# EAGLE design raspi-rnc (EAGLE 6.6.0)
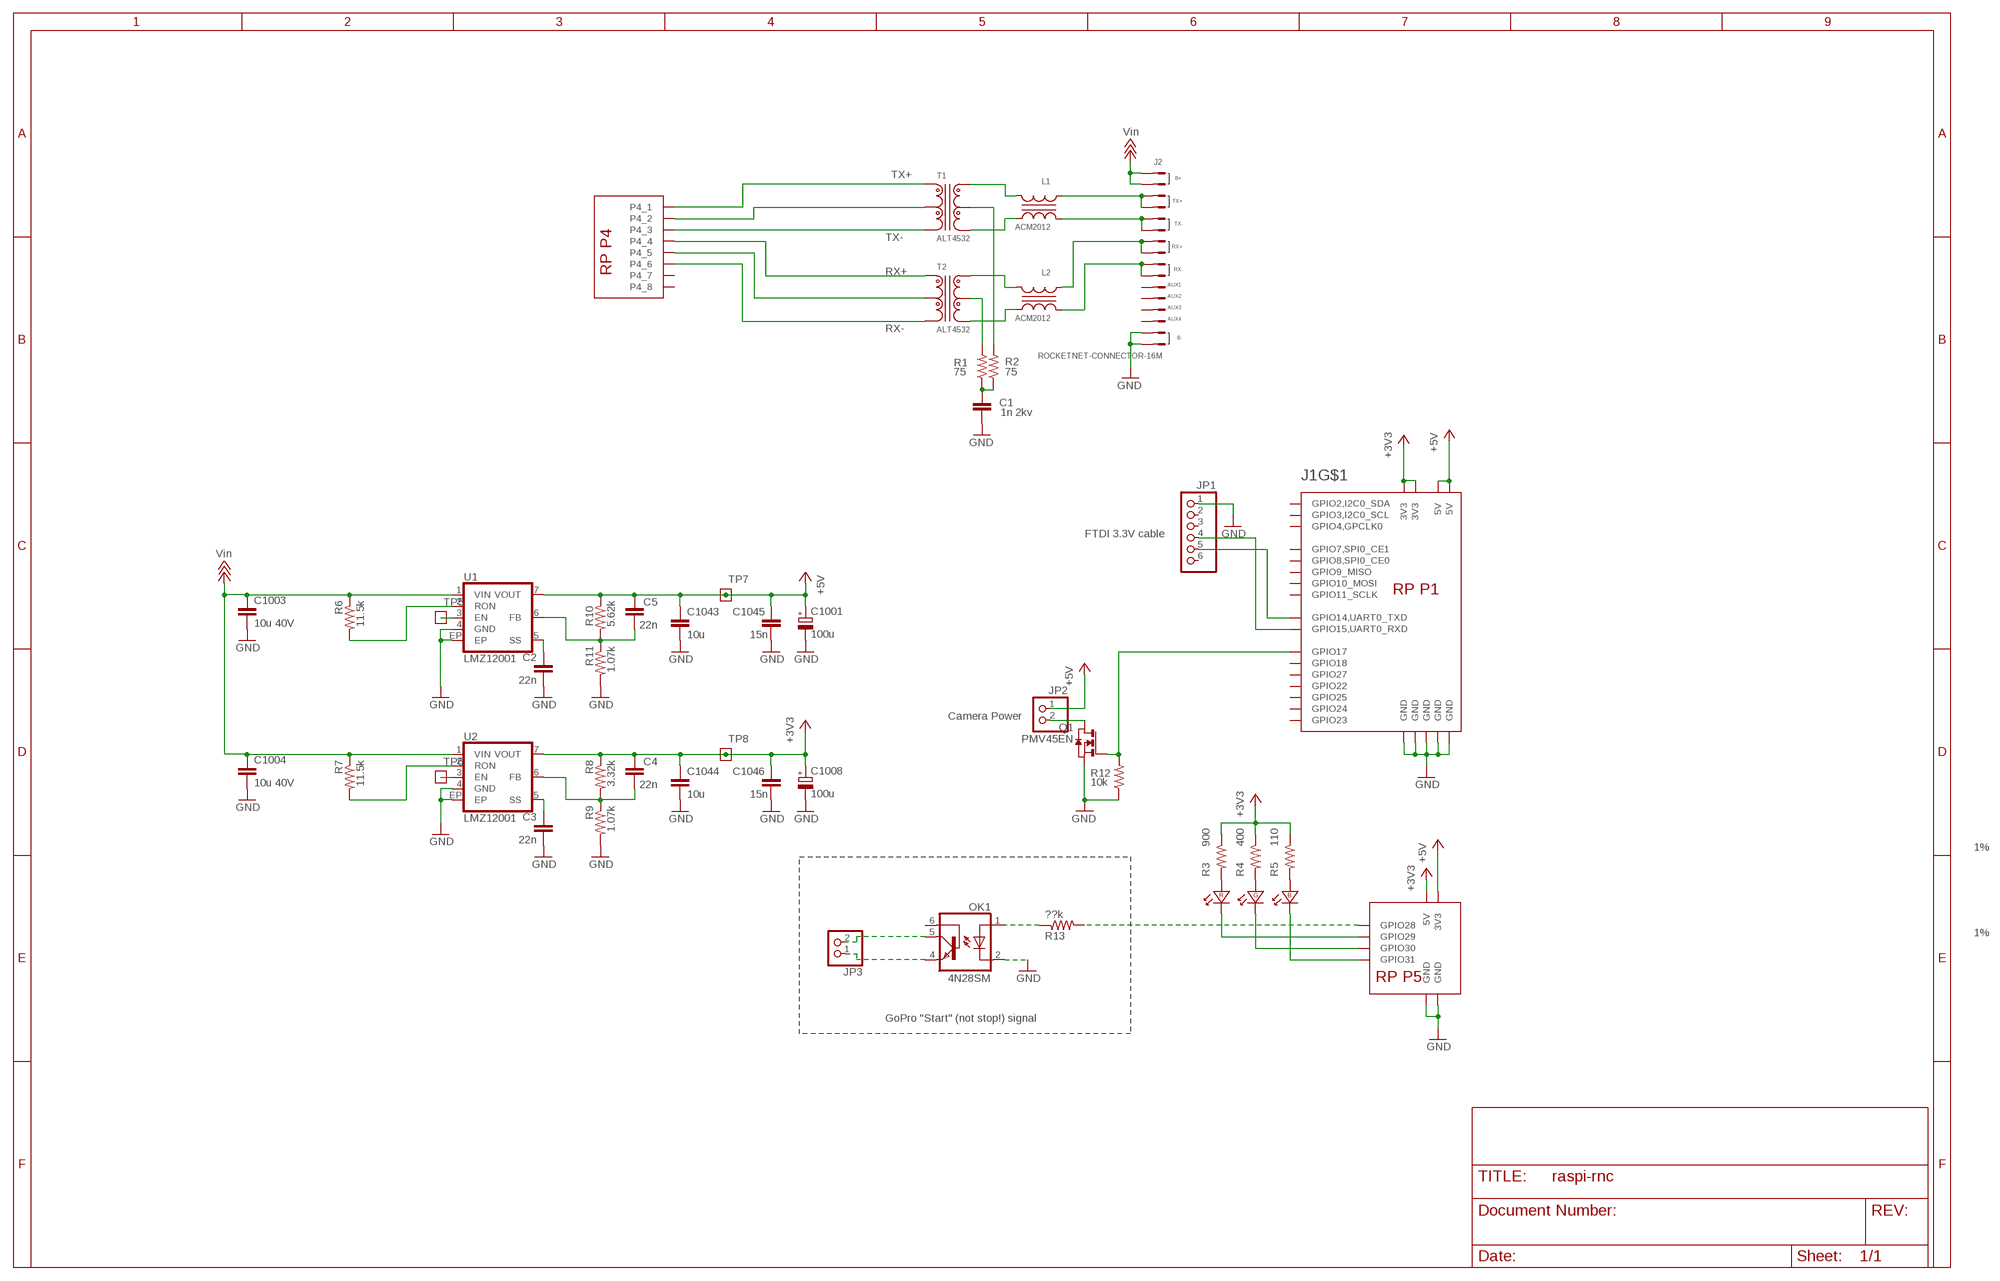
[diagram p0: schematic, sheet 1]

## Parts
C1  1n 2kv  C-EU0603-B-NOSILK  [0603-B-NOSILK]
C2  22n  C-EU0603-B-NOSILK  [0603-B-NOSILK]
C3  22n  C-EU0603-B-NOSILK  [0603-B-NOSILK]
C4  22n  C-EU0603-B-NOSILK  [0603-B-NOSILK]
C5  22n  C-EU0603-B-NOSILK  [0603-B-NOSILK]
C1001  100u  CPOL-EUD/7343-31R  [D/7343-31R]
C1003  10u 40V  C-EU0805-B-NOSILK  [0805-B-NOSILK]
C1004  10u 40V  C-EU0805-B-NOSILK  [0805-B-NOSILK]
C1008  100u  CPOL-EUD/7343-31R  [D/7343-31R]
C1043  10u  C-EU0805-B-NOSILK  [0805-B-NOSILK]
C1044  10u  C-EU0805-B-NOSILK  [0805-B-NOSILK]
C1045  15n  C-EU0603-B-NOSILK  [0603-B-NOSILK]
C1046  15n  C-EU0603-B-NOSILK  [0603-B-NOSILK]
J1  RP-REV2-MOAR  [RP_REV2_MOAR]
J2  ROCKETNET-CONNECTOR-16M  [ROCKETNET-M-16]
JP1  PINHD-1X6  [1X06]
JP2  PINHD-1X2  [1X02]
JP3  PINHD-1X2  [1X02]
L1  ACM2012  [TDK-ACM2012]
L2  ACM2012  [TDK-ACM2012]
LED3  LED_RGB_PLCC-6  [PLCC-6]
OK1  4N28SM  [DIL6-SMD]
Q1  PMV45EN  [SOT23]
R1  75  R-US_0603-B-NOSILK  [0603-B-NOSILK]
R2  75  R-US_0603-B-NOSILK  [0603-B-NOSILK]
R3  900  R-US_0603-B-NOSILK  [0603-B-NOSILK]
R4  400  R-US_0603-B-NOSILK  [0603-B-NOSILK]
R5  110  R-US_0603-B-NOSILK  [0603-B-NOSILK]
R6  11.5k  R-US_0603-B-NOSILK  [0603-B-NOSILK]
R7  11.5k  R-US_0603-B-NOSILK  [0603-B-NOSILK]
R8  3.32k  R-US_0603-B-NOSILK  [0603-B-NOSILK]
R9  1.07k  R-US_0603-B-NOSILK  [0603-B-NOSILK]
R10  5.62k  R-US_0603-B-NOSILK  [0603-B-NOSILK]
R11  1.07k  R-US_0603-B-NOSILK  [0603-B-NOSILK]
R12  10k  R-US_0603-B-NOSILK  [0603-B-NOSILK]
R13  ??k  R-US_0603-B-NOSILK  [0603-B-NOSILK]
T1  ALT4532  [TDK-ALT4532]
T2  ALT4532  [TDK-ALT4532]
TP5  TEST-POINT  [2MM-TEST-POINT]
TP6  TEST-POINT  [2MM-TEST-POINT]
TP7  TEST-POINT  [2MM-TEST-POINT]
TP8  TEST-POINT  [2MM-TEST-POINT]
U1  LMZ12001  LMZ14203  [TO-PMOD-7]
U2  LMZ12001  LMZ14203  [TO-PMOD-7]

## Nets
+3V3: C4.1 C1008.+ C1044.1 C1046.1 J1.P1_1(3V3) J1.P1_17(3V3) J1.P5_1(5V) R3.1 R4.1 R5.1 R8.1 TP8.1 U2.7(VOUT)
+5V: C5.1 C1001.+ C1043.1 C1045.1 J1.P1_2(5V) J1.P1_4(5V) J1.P5_2(3V3) JP2.1 R10.1 TP7.1 U1.7(VOUT)
GND: C1.2 C2.2 C3.2 C1001.- C1003.2 C1004.2 C1008.- C1043.2 C1044.2 C1045.2 C1046.2 J1.P1_6(GND) J1.P1_9(GND) J1.P1_14(GND) J1.P1_20(GND) J1.P1_25(GND) J1.P5_7(GND) J1.P5_8(GND) J2.B-@1(B-) J2.B-@2(B-) JP1.1 OK1.2(C) Q1.2(S) R9.2 R11.2 R12.1 U1.4(GND) U1.EP U2.4(GND) U2.EP
N$1: J1.P4_2 T1.6
N$2: J1.P5_4(GPIO29) LED3.6(R:K)
N$3: L1.4 T1.5
N$4: J1.P5_5(GPIO30) LED3.2(G:K)
N$5: L1.3 T1.4
N$6: L2.4 T2.5
N$7: L2.3 T2.4
N$8: J2.T+@13(TX+) J2.T+@14(TX+) L1.1
N$9: J2.T-@9(TX-) J2.T-@11(TX-) L1.2
N$10: J2.R+@5(RX+) J2.R+@7(RX+) L2.1
N$11: J1.P4_1 T1.1
N$12: J1.P4_3 T1.2
N$13: J1.P4_4 T2.1
N$14: J1.P4_6 T2.2
N$15: J1.P5_6(GPIO31) LED3.5(B:K)
N$16: J1.P4_5 T2.6
N$17: C3.1 U2.5(SS)
N$18: C2.1 U1.5(SS)
N$19: J2.R-@3(RX-) J2.R-@4(RX-) L2.2
N$20: J1.P5_3(GPIO28) R13.2
N$21: OK1.1(A) R13.1
N$23: JP3.2 OK1.5(COL)
N$24: R6.2 U1.2(RON)
N$25: C1.1 R1.1 R2.1
N$26: R1.2 T2.3
N$27: R2.2 T1.3
N$28: LED3.1(R:A) R3.2
N$29: LED3.3(G:A) R4.2
N$30: LED3.4(B:A) R5.2
N$31: R7.2 U2.2(RON)
N$32: TP5.1 U1.3(EN)
N$33: TP6.1 U2.3(EN)
N$34: C4.2 R8.2 R9.1 U2.6(FB)
N$35: C5.2 R10.2 R11.1 U1.6(FB)
N$36: J1.P1_10(GPIO15,UART0_RXD) JP1.4
N$37: J1.P1_8(GPIO14,UART0_TXD) JP1.5
N$38: J1.P1_26(GPIO17) Q1.1(G) R12.2
N$39: JP3.1 OK1.4(EMI)
N$40: JP2.2 Q1.3(D)
TRIPLE_UP_ARROW: C1003.1 C1004.1 J2.B+@15(B+) J2.B+@16(B+) R6.1 R7.1 U1.1(VIN) U2.1(VIN) ; supply symbol labelled Vin
Unconnected: J1.P1_3(GPIO2,I2C0_SDA) J1.P1_5(GPIO3,I2C0_SCL) J1.P1_7(GPIO4,GPCLK0) J1.P1_11(GPIO7,SPI0_CE1) J1.P1_12(GPIO8,SPI0_CE0) J1.P1_13(GPIO27) J1.P1_15(GPIO22) J1.P1_16(GPIO23) J1.P1_18(GPIO24) J1.P1_19(GPIO10_MOSI) J1.P1_21(GPIO9_MISO) J1.P1_22(GPIO25) J1.P1_23(GPIO11_SCLK) J1.P1_24(GPIO18) J1.P4_7 J1.P4_8 J2.A1(AUX1) J2.A2(AUX2) J2.A3(AUX3) J2.A4(AUX4) JP1.2 JP1.3 JP1.6 OK1.6(BAS)

## Notes on the sheet
- TX+
- TX-
- RX+
- RX-
- FTDI 3.3V cable
- Camera Power
- 1%
- 1%
- GoPro "Start" (not stop!) signal

## Library data of the parts
C1-C5 C1003 C1004 C1043-C1046 = rcl_custom:C-EU: CAPACITOR, European symbol
C1001 C1008 = rcl:CPOL-EU: POLARIZED CAPACITOR, European symbol
J1 = RaspberryPi:RP-REV2-MOAR
J2 = rocketnet-connector:ROCKETNET-CONNECTOR-16
JP1 = pinhead:PINHD-1X6: PIN HEADER
JP2 JP3 = pinhead:PINHD-1X2: PIN HEADER
L1 L2 = magnetics:ACM2012
LED3 = Tova:LED_RGB_*: RGB LED with separate contacts for all 3 chips
OK1 = optocoupler:4N*?M: General Purpose 6-Pin Phototransistor Optocouplers Source: http://www.fairchildsemi.com/ds/4N/4N35-M.pdf; MF: FAIRCHILD SEMICONDUCTOR; MPN: 4N28S-M; OC_FARNELL: unknown; OC_NEWARK: 05C3314
Q1 = Tova:PMV45EN
R1-R13 = rcl_custom:R-US_: RESISTOR, American symbol
T1 T2 = magnetics:ALT4532
TP5-TP8 = apdm:TEST-POINT
U1 U2 = SparkFun-PowerIC:LMZ14203: 3A, Simple Switcher Power Module with 42V Maximum Input

## Board
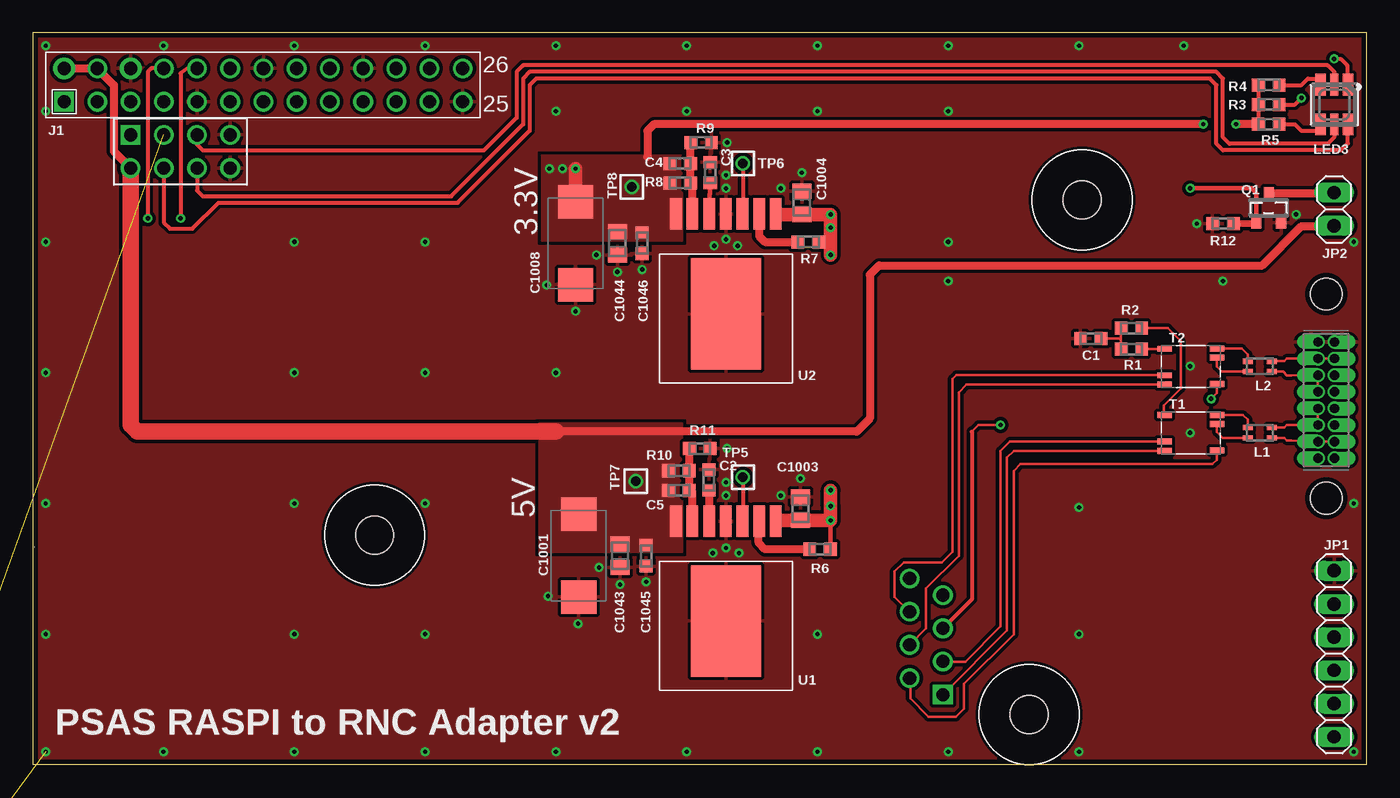
[diagram p1: board, top side]
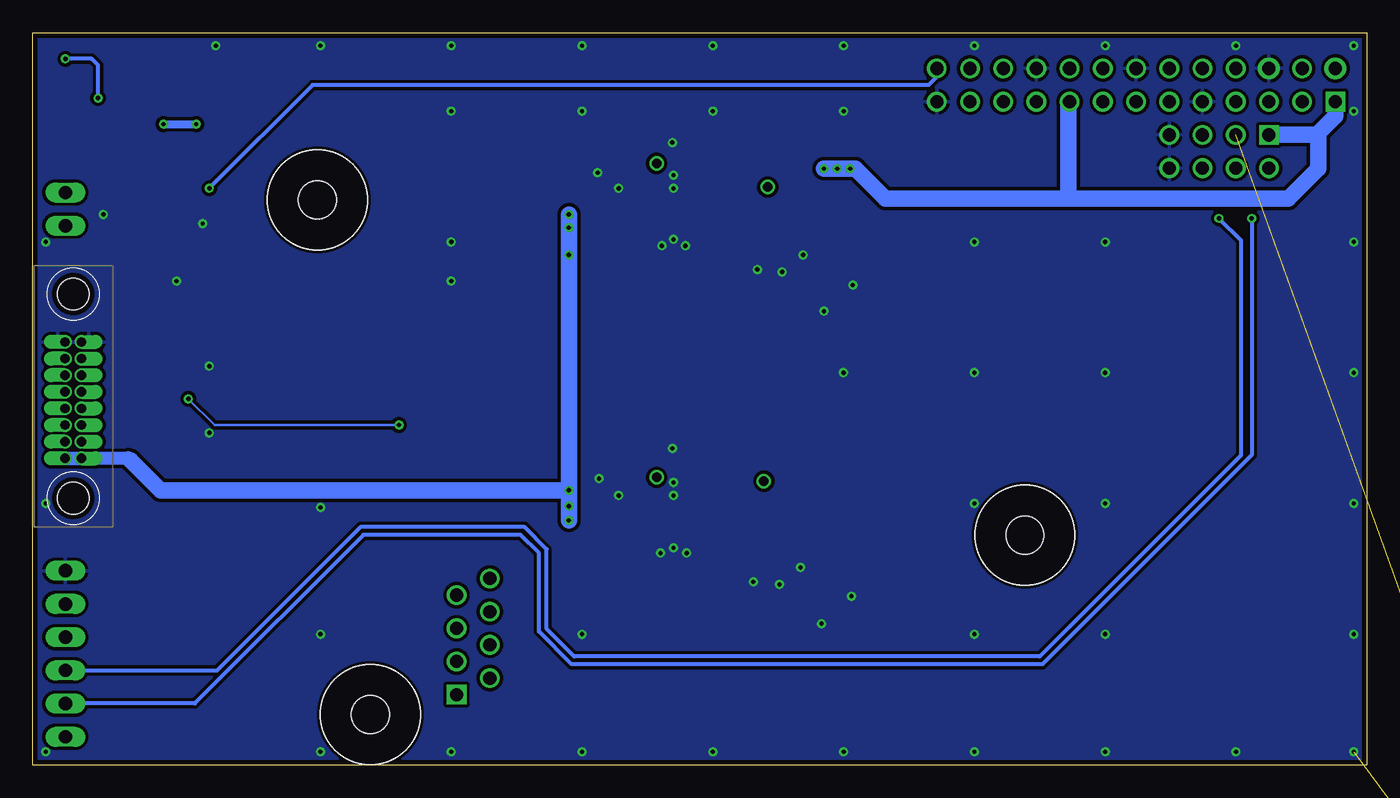
[diagram p2: board, bottom side, seen from below]

Size 102 x 56 mm. Coordinates in mm from the lower left corner, seen from the top.
Outline: 102,0 102,56 0,56 0,0 102,0
Copper layers (1*16): Top 0.0356mm / dielectric 1.5011mm / Bottom 0.0356mm
Design rules "osh-park-2layer *": minimum track width 6mil, minimum drill 13mil, track to track 6mil, track to pad 6mil, pad to pad 6mil, via to via 6mil, smd to smd 6mil, copper to edge 15mil, drill to drill 6mil, minimum pad ring 7mil, minimum via ring 7mil, stop-mask expansion 3mil, vias tented up to drill 20mil, thermal gap 10mil

### Footprints (pad centres in the part's own frame; a part is rotated, then mirrored left to right if it is on the bottom)
0603-B-NOSILK = smd 0.95 x 1: 1 -0.8,0; 2 0.8,0
D/7343-31R = smd 2.55 x 2.7: + 3.175,0; - -3.175,0
0805-B-NOSILK = smd 1.15 x 1.45: 1 -0.9,0; 2 0.9,0
RP_REV2_MOAR = drill 1 square: P1_1 2.4,50.725; P4_1 69.59,5.37; P5_1 7.48,48.185 | drill 1 pad 1.676: P1_2 2.4,53.265; P1_6 7.48,53.265 | drill 1: P1_3 4.94,50.725; P1_4 4.94,53.265; P1_5 7.48,50.725; P1_7 10.02,50.725; P1_8 10.02,53.265; P1_9 12.56,50.725; P1_10 12.56,53.265; P1_11 15.1,50.725; P1_12 15.1,53.265; P1_13 17.64,50.725; P1_14 17.64,53.265; P1_15 20.18,50.725; P1_16 20.18,53.265; P1_17 22.72,50.725; P1_18 22.72,53.265; P1_19 25.26,50.725; P1_20 25.26,53.265; P1_21 27.8,50.725; P1_22 27.8,53.265; P1_23 30.34,50.725; P1_24 30.34,53.265; P1_25 32.88,50.725; P1_26 32.88,53.265; P4_2 67.05,6.64; P4_3 69.59,7.91; P4_4 67.05,9.18; P4_5 69.59,10.45; P4_6 67.05,11.72; P4_7 69.59,12.99; P4_8 67.05,14.26; P5_2 7.48,45.645; P5_3 10.02,48.185; P5_4 10.02,45.645; P5_5 12.56,48.185; P5_6 12.56,45.645; P5_7 15.1,48.185; P5_8 15.1,45.645 | hole 2.9: 80.23,43.215; 26.14,17.565; 76.18,3.845
ROCKETNET-M-16 = drill 0.71 pad 0.95 offset: A1 -1.905,0.635; A2 -0.635,0.635; A3 0.635,0.635; A4 1.905,0.635; B+@15 4.445,-0.635; B+@16 4.445,0.635; B-@1 -4.445,-0.635; B-@2 -4.445,0.635; R+@5 -1.905,-0.635; R+@7 -0.635,-0.635; R-@3 -3.175,-0.635; R-@4 -3.175,0.635; T+@13 3.175,-0.635; T+@14 3.175,0.635; T-@9 0.635,-0.635; T-@11 1.905,-0.635 | hole 2.438: 7.5,0; -8.1,0
1X06 = drill 1.016 long: 1 -6.35,0; 2 -3.81,0; 3 -1.27,0; 4 1.27,0; 5 3.81,0; 6 6.35,0
1X02 = drill 1.016 long: 1 -1.27,0; 2 1.27,0
TDK-ACM2012 = smd 0.75 x 0.4: 1 -0.925,0.4; 2 -0.925,-0.4; 3 0.925,-0.4; 4 0.925,0.4
PLCC-6 = smd 1.65 x 0.8: 1 -1.525,1.05; 3 -1.525,-1.05; 4 1.525,-1.05; 6 1.525,1.05 | smd 1.65 x 0.6: 2 -1.525,0; 5 1.525,0
DIL6-SMD = smd 1.78 x 1.52: 1 -2.54,-4.645; 2 0,-4.645; 3 2.54,-4.645; 4 2.54,4.645; 5 0,4.645; 6 -2.54,4.645
SOT23 = smd 0.787 x 0.889: 1 -0.953,-1.143; 2 0.953,-1.143; 3 0,1.143
TDK-ALT4532 = smd 1.1 x 0.45: 1 -2,-1.375; 2 -2,-0.675; 3 -2,1.35; 4 2,1.375; 5 2,0.675; 6 2,-1.35
2MM-TEST-POINT = drill 0.737: 1 0,0
TO-PMOD-7 = smd 0.89 x 2.41: 1 -3.81,-7.63; 2 -2.54,-7.63; 3 -1.27,-7.63; 4 0,-7.63; 5 1.27,-7.63; 6 2.57,-7.63; 7 3.81,-7.63 | smd 5.35 x 8.54: EP 0,0

### Placement (x,y rotation side)
C1  80.9,32.6 180 top
C2  51.7,21.8 90 top
C3  51.8,45.3 90 top
C4  49.5,46 0 top
C5  49.4,21 0 top
C1001  41.74,16.01 90 top
C1003  58.7,19.6 90 top
C1004  58.8,43 90 top
C1008  41.5,39.9 90 top
C1043  44.9,16 270 top
C1044  44.7,39.9 270 top
C1045  46.9,16 270 top
C1046  46.6,39.9 270 top
J1  0,0 0 top
J2  98.9,27.9 270 top
JP1  99.5,8.5 270 top
JP2  99.5,42.5 90 top
JP3  -11.9,-20.8 0 top  (outside the outline)
L1  93.82,25.4 180 top
L2  93.82,30.48 180 top
LED3  99.5,50.5 270 top
OK1  -8.2,-6.8 0 top  (outside the outline)
Q1  94.5,42.6 0 top
R1  84,31.8 0 top
R2  84,33.4 0 top
R3  94.5,50.5 0 top
R4  94.5,52 0 top
R5  94.5,49 0 top
R6  60.2,16.5 180 top
R7  59.3,40 180 top
R8  49.5,44.5 0 top
R9  51.1,47.6 0 top
R10  49.4,22.5 0 top
R11  51,24.2 0 top
R12  91,41.4 0 top
R13  -13.4,-14.7 0 top  (outside the outline)
T1  88.54,25.4 0 top
T2  88.54,30.48 0 top
TP5  54.3,22 0 top
TP6  54.3,46 0 top
TP7  46.1,21.7 0 top
TP8  45.8,44.2 0 top
U1  53,11 180 top
U2  53,34.5 180 top

### Tracks (layer width: path | path; a pad name or v marks a point on that pad's centre or on a via)
+3V3  (via drill 0.33)
  Top 0.305: R4.1 R3.1 R5.1
  Top 0.61: R5.1 v92,49 | v89.5,49 47.5,49 47,48.5 47,46.5
  Top 1.016: v41.5,45.6 C1008.+
  Bottom 0.61: v92,49 v89.5,49
  Bottom 1.016: 3.7,48.3 3.8,48.2 | 7.46,48.2 J1.P5_1 | 22.8,50.65 J1.P1_17
  Bottom 1.27: J1.P1_1 2.4,49.6 3.7,48.3 3.7,45.6 6,43.3 22.8,43.3 | 3.8,48.2 7.46,48.2 | 22.8,43.3 22.8,50.65 | 22.8,43.3 36.8,43.3 39.1,45.6 v41.5,45.6
  other vias: 40.5,45.6 39.5,45.6
  pour Top (isolate 0.254, no thermals): 49.7,40.1 49.7,46.6 38.9,46.6 38.9,40.1
+5V
  Top 0.305: 7.5,45.62 7.06,46.06
  Top 0.61: J1.P1_2 J1.P1_4 6.2,52 6.2,46.92 7.06,46.06 J1.P5_2 | 38.78,25.5 40,25.5 63,25.5 64,26.5 64,37.5 64.7,38.2 94,38.2 97,41.2 99.47,41.2 JP2.1
  Top 1.27: 7.5,45.62 7.5,26 8,25.5 40,25.5
  pour Top (isolate 0.254, rank 2, no thermals): 49.7,16.3 49.7,26.1 38.7,26.1 38.7,16.3
GND  (via drill 0.33)  (1 unrouted)
  other vias: 1,40 1,30 1,20 1,10 1,1 10,1 20,1 30,1 40,1 50,1 60,1 70,1 80,1 101,20 88,55 80,55 101,40 70,55 60,55 50,55 40,55 30,55 20,55 10,55 1,55 1,50 101,1 20,40 20,30 20,20 20,10 30,10 30,20 30,30 30,40 40,30 70,40 80,10 60,10 80,19.7 70,50 40,50 50,50 60,50 96.6,42.1 89,41.4 70,37 91,37 53,44.1 53,45.1 53,40.2 52.1,39.7 53.9,39.7 53.1,47.6 53,20.6 53,16.6 52,16.2 54,16.2 46.9,14 44.9,13.8 41.7,10.8 43.3,15.1 39.4,12.9 46.6,37.9 44.7,37.7 41.5,34.7 39.3,36.7 43.1,39 53,21.6 53.1,24.2 58.7,21.9 57.2,20.6 58.8,45.3 57.2,44.1 88.5,25.4 88.5,30.5
  pour Top (isolate 0.254, rank 6): 0,0 0,56 102,56 102,0
  pour Bottom (isolate 0.254): 0,0 0,56 102,56 102,0
N$1
  Top 0.2: T1.6 90.54,23.34 90.2,23 75.5,23 75,22.5 75,10 71.2,6.2 71.2,4.3 70.6,3.7 68.5,3.7 67.1,5.1 67.1,6.59 J1.P4_2
N$2
  Top 0.305: J1.P5_4 10.02,41.48 10.5,41 12.2,41 14.2,43 32.5,43 38,48.5 38,52 38.5,52.5 90,52.5 90.5,52 90.5,47.5 91,47 100,47 100.55,47.55 LED3.6
N$3
  Top 0.2: L1.4 91,25 90.54,25.46 T1.5
N$4
  Top 0.305: J1.P5_5 12.56,47.44 13,47 34.5,47 37,49.5 37,53 37.5,53.5 99,53.5 99.5,53 LED3.2
N$5
  Top 0.2: T1.4 92.53,26.77 92.89,26.41 L1.3
N$6
  Top 0.2: T2.5 90.54,30.46 90.92,30.08 L2.4
N$7
  Top 0.2: T2.4 92.44,31.86 92.89,31.41 L2.3
N$8
  Top 0.2: J2.T+@14 J2.T+@13 96.23,24.8 95.9,24.8 95.7,25 L1.1
N$9
  Top 0.2: J2.T-@9 J2.T-@11 96.23,26 95.9,26 95.7,25.8 L1.2
N$10
  Top 0.2: J2.R+@7 J2.R+@5 96.22,29.8 95.9,29.8 95.62,30.08 L2.1
N$11
  Top 0.2: T1.1 75.03,24.02 74.5,23.5 74.5,10.28 J1.P4_1
N$12
  Top 0.2: T1.2 74.72,24.73 74,24 74,10.6 71.3,7.9 J1.P4_3
N$13
  Top 0.2: T2.1 71.41,29.11 70.8,28.5 70.8,16 68.3,13.5 68.3,10.43 J1.P4_4
N$14
  Top 0.2: T2.2 70.61,29.8 70.3,29.5 70.3,16.3 69.5,15.5 66.6,15.5 65.9,14.8 65.9,12.87 J1.P4_6
N$15
  Top 0.305: LED3.5 99.5,48 99,47.5 91.5,47.5 91,48 91,52.5 90.5,53 38,53 37.5,52.5 37.5,49 32,43.5 13,43.5 12.56,43.94 J1.P5_6
N$16  (via drill 0.33)
  Top 0.2: 71.8,25.5 72.3,26 v74,26 | T2.6 90.54,28.44 v90.1,28
  Top 0.305: 71.8,25.5 71.8,12.66 J1.P4_5
  Bottom 0.2: v74,26 88.1,26 v90.1,28
N$17
  Top 0.33: U2.5 51.73,43.63 51.8,43.7 C3.1
N$18
  Top 0.61: U1.5 51.73,20.93 C2.1
N$19
  Top 0.2: J2.R-@4 J2.R-@3 96.25,31.1 95.9,31.1 95.68,30.88 L2.2
N$20  (1 unrouted)
N$21  (1 unrouted)
N$23  (1 unrouted)
N$24
  Top 0.61: R6.2 56,16.5 55.5,17 55.5,18.59 U1.2
N$25
  Top 0.2: R2.1 83.2,32.5 | 83.2,32.5 R1.1 83.3,31.7 | C1.1 83.1,32.6 83.2,32.5
N$26
  Top 0.2: R1.2 86.51,31.8 T2.3
N$27
  Top 0.2: R2.2 86.8,33.4 87.8,32.4 87.8,28.8 86.5,27.5 86.5,26.79 T1.3
N$28  (via drill 0.33)
  Top 0.305: R3.2 96.5,50.5 v97,51 | v99.5,54 100,54 100.5,53.5 100.5,52.08 LED3.1
  Bottom 0.305: v97,51 97,53.5 97.5,54 v99.5,54
N$29
  Top 0.305: R4.2 97,52 97.5,52.5 98.5,52.5 98.45,52.45 LED3.3
N$30
  Top 0.305: R5.2 96.5,49 97,48.5 98.5,48.5
  Top 0.406: 98.5,48.5 98.45,48.55 LED3.4
N$31
  Top 0.61: U2.2 55.54,40.46 56,40 R7.2
N$32
  Top 0.305: TP5.1 54.3,18.66 U1.3
N$33
  Top 0.305: TP6.1 54.3,42.16 U2.3
N$34
  Top 0.61: U2.6 50.43,44.37 R8.2 C4.2 R9.1
N$35
  Top 0.61: U1.6 50.43,20.87 C5.2 R10.2 R11.1
N$36  (via drill 0.33)
  Top 0.305: J1.P1_10 11.87,53.27 11.3,52.9 v11.3,41.8
  Bottom 0.305: JP1.4 87.9,7.23 76.93,18.2 64.4,18.2 62.7,16.5 62.7,10.4 60.6,8.3 25,8.3 9.6,23.7 9.6,40.1 v11.3,41.8
N$37  (via drill 0.33)
  Top 0.305: J1.P1_8 9.06,53.27 8.8,53 v8.8,41.8
  Bottom 0.305: JP1.5 89.6,4.7 76.7,17.6 64.7,17.6 63.3,16.2 63.3,10.2 60.8,7.7 24.8,7.7 8.8,23.7 v8.8,41.8
N$38  (via drill 0.33)
  Top 0.33: Q1.1 93.55,43.75 93.19,44.1 v88.5,44.1
  Top 0.5: R12.2 93.55,41.4 Q1.1
  Bottom 0.305: J1.P1_26 32.88,52.62 33.5,52 80.6,52 v88.5,44.1
N$39  (1 unrouted)
N$40
  Top 0.61: Q1.3 99.47,43.74 JP2.2
TRIPLE_UP_ARROW  (via drill 0.33)
  Top 0.33: v61,18.7 61,16.6 60.9,16.5 R6.1
  Top 0.406: R7.1 61,40
  Top 0.61: 56.81,42 U2.1
  Top 0.8: U1.1 56.81,18.61 56.8,18.6 57.1,18.7 | U2.1 56.97,42.13 57,42.1
  Top 1.016: 57.1,18.7 C1003.1 v61,18.7 v61,19.8 v61,21 | 57,42.1 C1004.1 v61,42.1 v61,41.1 61,40 v61,39
  Bottom 1.016: J2.B+@16 J2.B+@15 94.69,23.5 94.5,23.3
  Bottom 1.27: v61,21 92.2,21 94.5,23.3 | v61,21 v61,18.7 | v61,21 v61,42.1

### Text on the board
tPlace: 3.3V | 5V | PSAS RASPI to RNC Adapter v2
tDocu: - Board fits UNDER RP rev 2 | - Remove P1 header and move to BOTTOM of RP. | - Remove RG2 (NCP1117-3v3) and F3. | - Remove P4 (Ethernet jack). | - Remove RCA, audio, USB as necessary.